# EAGLE design samd21_actuatorhub_Lite_TQFP32_1.1.2Feb_feb2023 (EAGLE 9.6.2)
MODEL: SensorHub Lite; VERSION: V1.1.2 Feb 2023

## Sheet 1 of 3
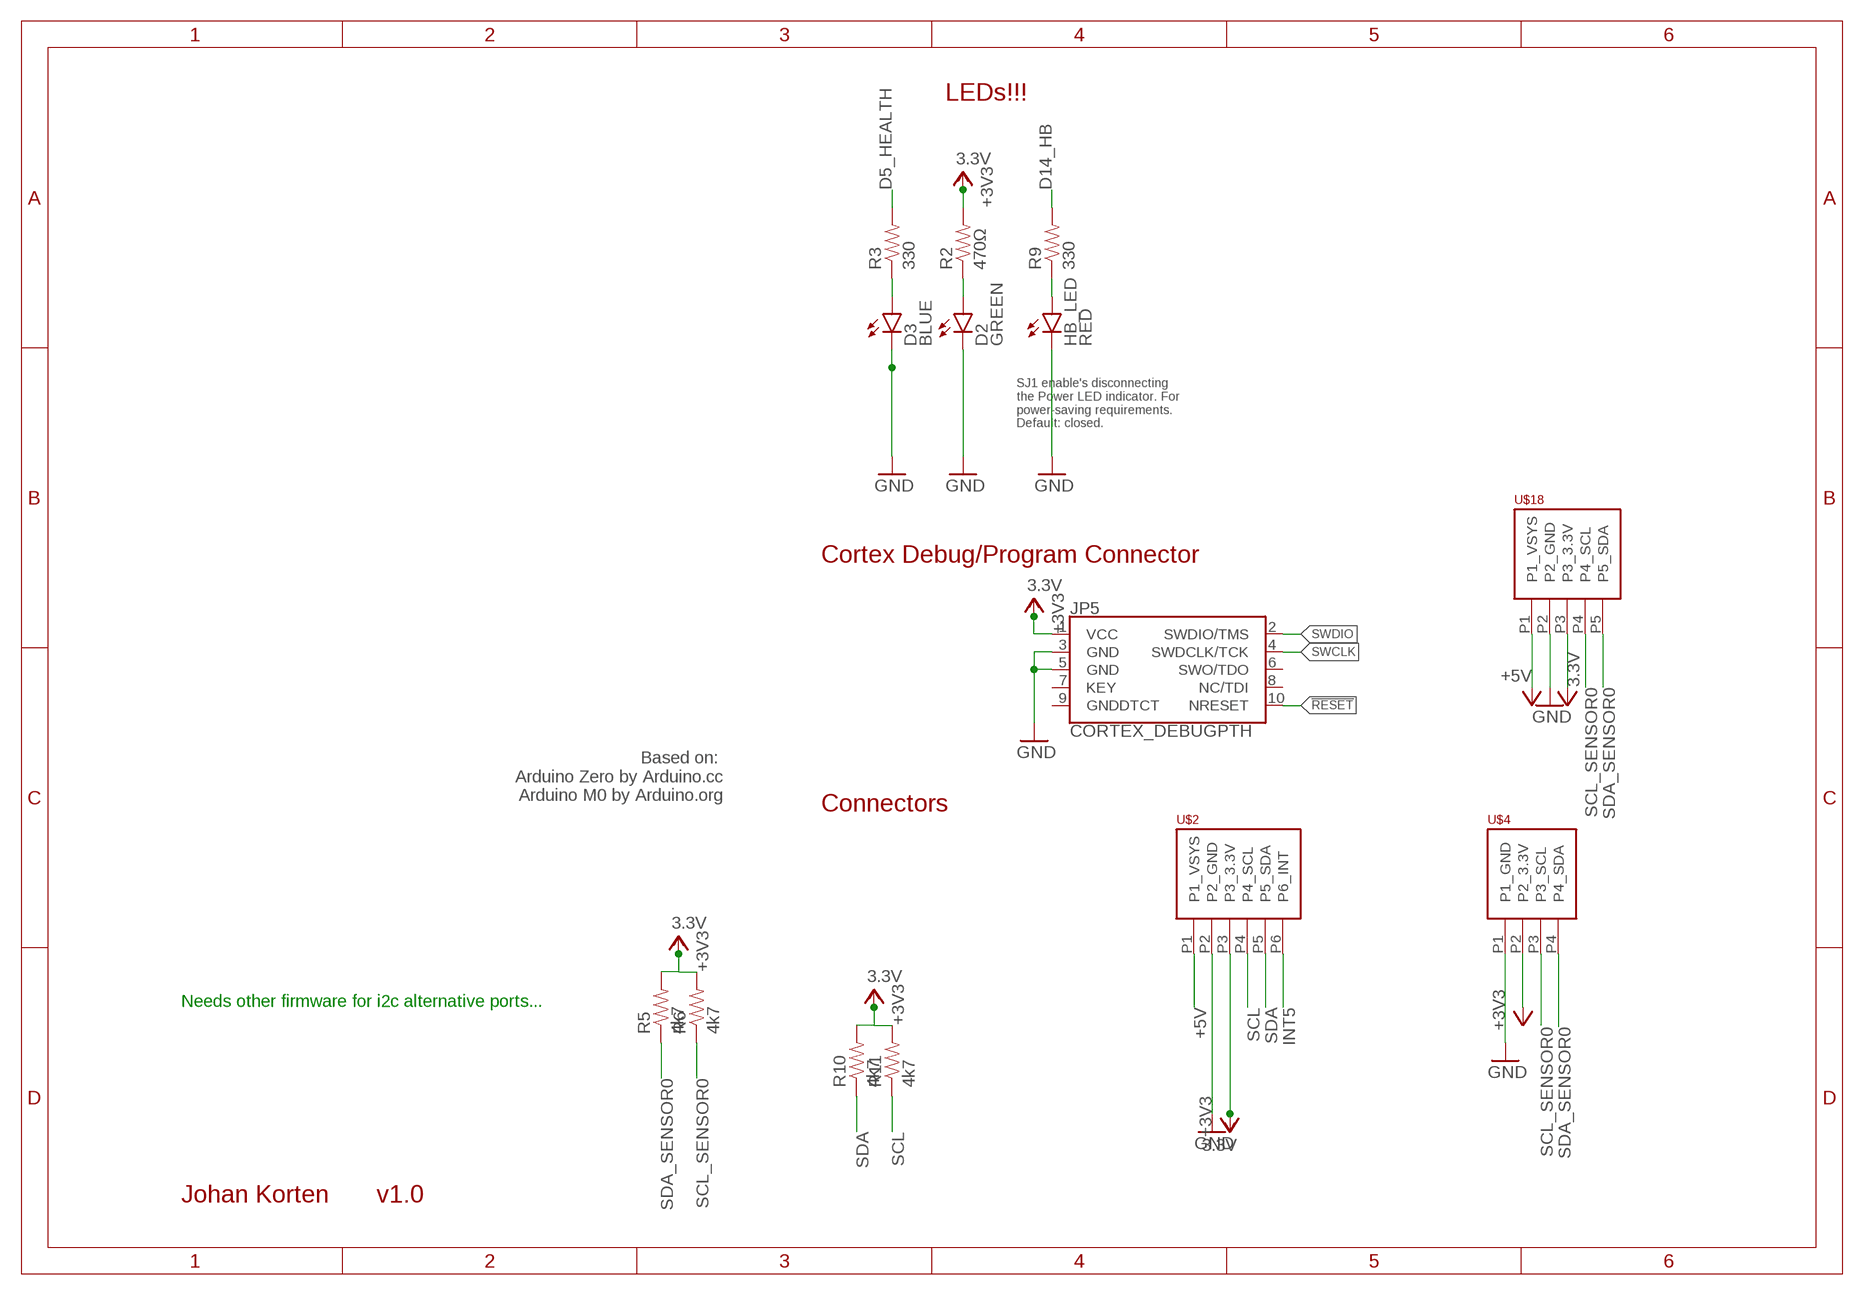
[diagram p0: schematic, sheet 1]

### Parts
D2  GREEN  LED-RED0603  [LED-0603]
D3  BLUE  LED-BLUE0603  [LED-0603]
HB_LED  RED  LED-RED0603  [LED-0603]
JP5  CORTEX_DEBUGPTH  [2X5-PTH-1.27MM]
R2  470Ω  330OHM1/10W1%(0603)  [0603-RES]
R3  330  330OHM1/10W1%(0603)  [0603-RES]
R5  4k7  330OHM1/10W1%(0603)  [0603-RES]
R6  4k7  330OHM1/10W1%(0603)  [0603-RES]
R9  330  330OHM1/10W1%(0603)  [0603-RES]
R10  4k7  330OHM1/10W1%(0603)  [0603-RES]
R11  4k7  330OHM1/10W1%(0603)  [0603-RES]
U$2  PHOENIX_PTSM_M6_TH_I2CPPANGLE  [PTSM_M6_THRHOLE]
U$4  PHOENIX_PTSM_M4_THANGLE  [PTSM_M4_TH]
U$18  PHOENIX_PTSM_M5_TH_I2C++  [PTSM_M5_THRHOLE]

### Nets
3.3V [power]: JP5.1(VCC) R2.2 R5.2 R6.2 R10.2 R11.2 U$2.P3(P3_3.3V) U$4.P2(P2_3.3V) U$18.P3(P3_3.3V) ; supply symbol labelled +3V3 ; also sheet 2
!RESET: JP5.10(NRESET) ; also sheet 2
+5V: U$2.P1(P1_VSYS) U$18.P1(P1_VSYS) ; also sheet 2,3
D5_HEALTH: R3.2 ; also sheet 2
D5_HEALTH_LED: D3.A R3.1
D14_HB: R9.2 ; also sheet 2
D14_HB_LED: HB_LED.A R9.1
GND [ground]: D2.C D3.C HB_LED.C JP5.3(GND) JP5.5(GND) U$2.P2(P2_GND) U$4.P1(P1_GND) U$18.P2(P2_GND) ; also sheet 2,3
INT5: U$2.P6(P6_INT) ; also sheet 2
N$5: D2.A R2.1
SCL: R11.1 U$2.P4(P4_SCL) ; also sheet 2
SCL_SENSOR0: R6.1 U$4.P3(P3_SCL) U$18.P4(P4_SCL) ; also sheet 2
SDA: R10.1 U$2.P5(P5_SDA) ; also sheet 2
SDA_SENSOR0: R5.1 U$4.P4(P4_SDA) U$18.P5(P5_SDA) ; also sheet 2
SWCLK: JP5.4(SWDCLK/TCK) ; also sheet 2
SWDIO: JP5.2(SWDIO/TMS) ; also sheet 2
Unconnected: JP5.6(SWO/TDO) JP5.7(KEY) JP5.8(NC/TDI) JP5.9(GNDDTCT)

### Notes on the sheet
- LEDs!!!
- SJ1 enable's disconnecting
  the Power LED indicator. For
  power-saving requirements.
  Default: closed.
- Cortex Debug/Program Connector
- Based on: 
  Arduino Zero by Arduino.cc
  Arduino M0 by Arduino.org
- Connectors
- Needs other firmware for i2c alternative ports...
- Johan Korten | v1.0

## Sheet 2 of 3: Controller SAMD21 based on Adafruit Feather M0 Express
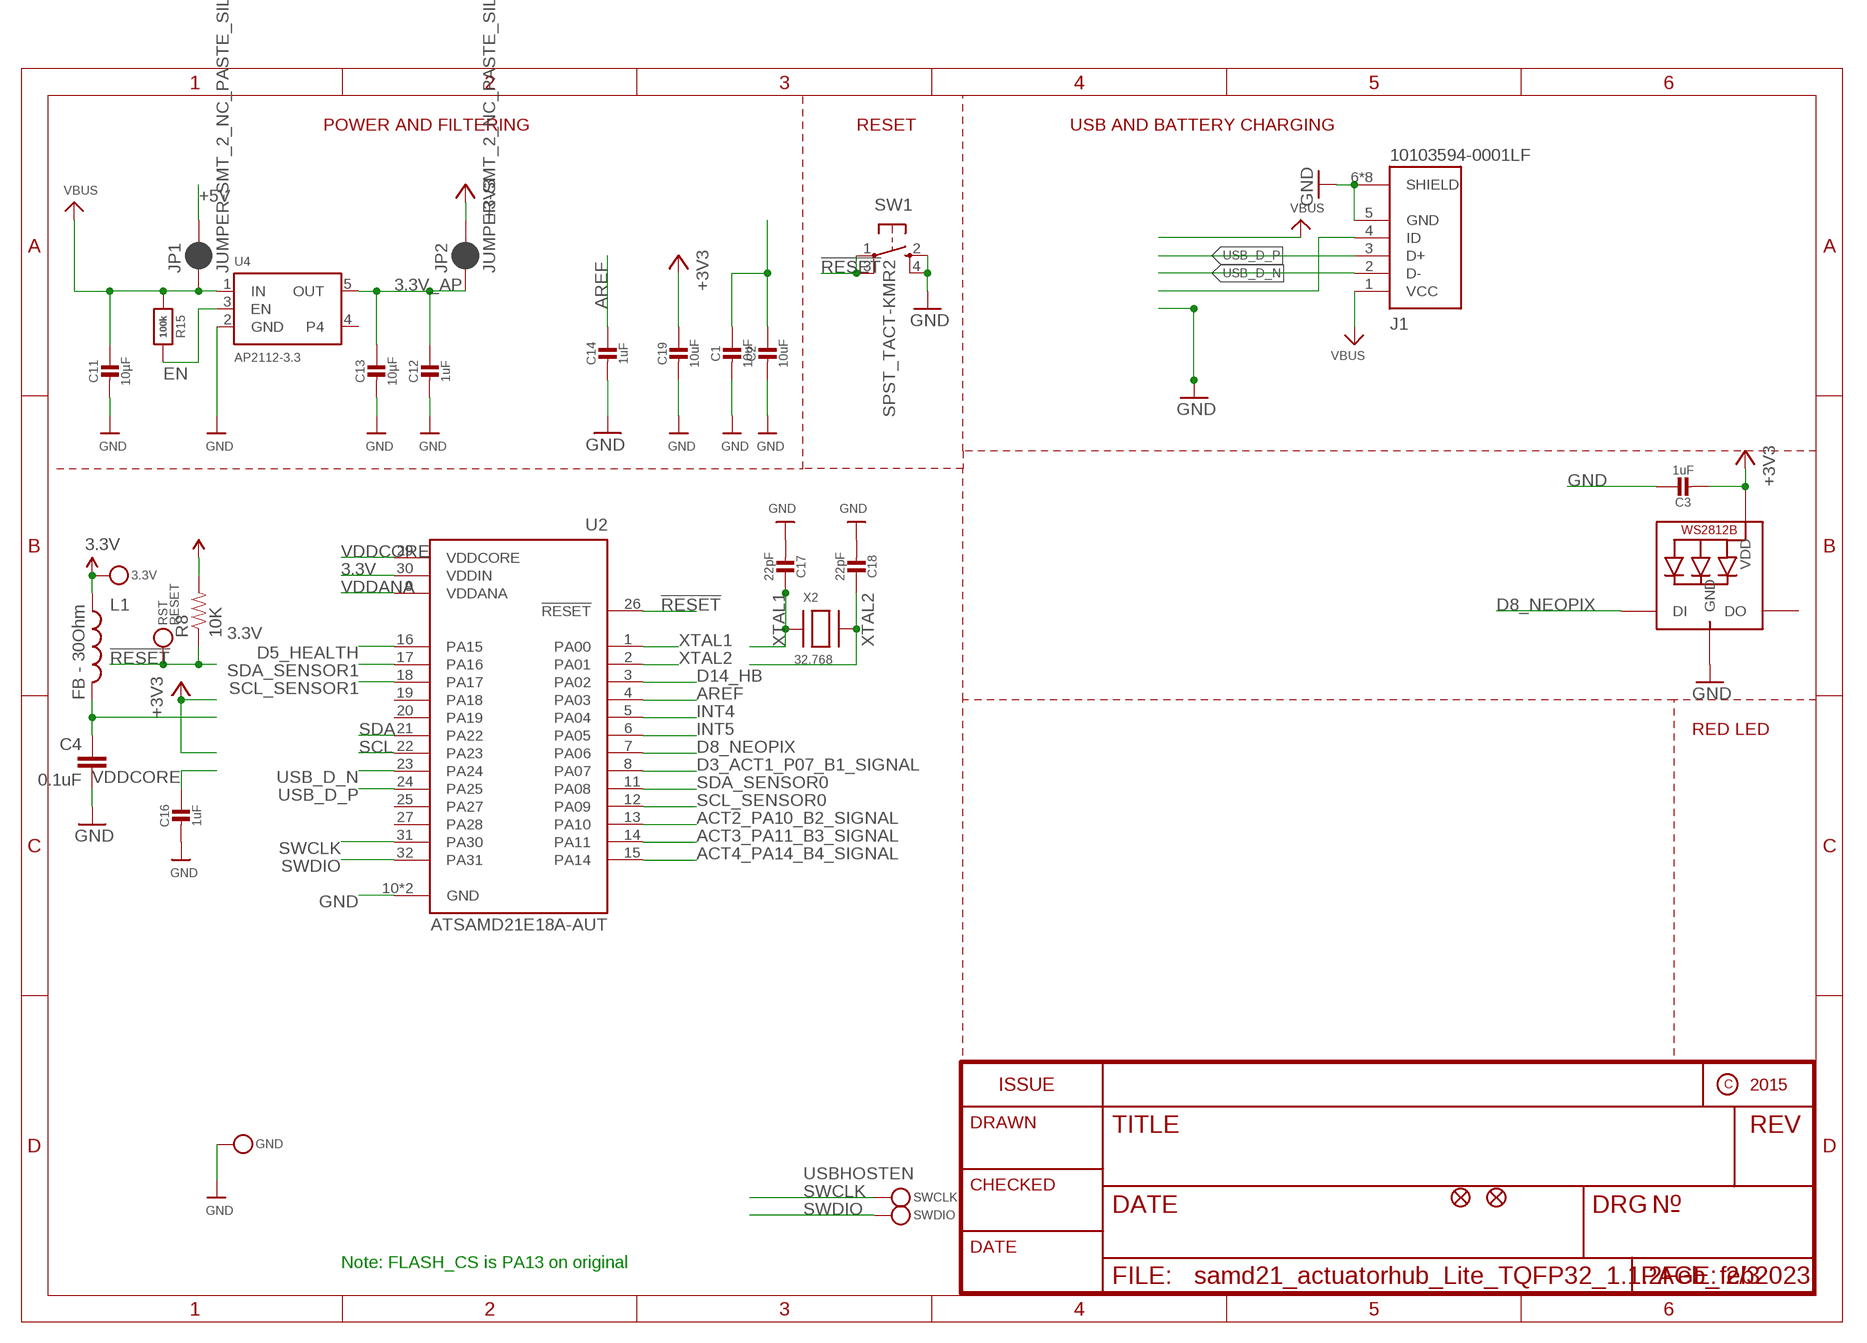
[diagram p1: schematic, sheet 2]

### Parts
3.3V  TESTPOINTROUND1.5MM  [TESTPOINT_ROUND_1.5MM]
C1  10uF  CAP_CERAMIC0805-NOOUTLINE  [0805-NO]
C2  10uF  CAP_CERAMIC0805-NOOUTLINE  [0805-NO]
C3  1uF  CAP_CERAMIC0603_NO  [0603-NO]
C4  0.1uF  0.1UF-16V(+-10%)(0402)  [0402-CAP]
C11  10µF  CAP_CERAMIC0805-NOOUTLINE  [0805-NO]
C12  1uF  CAP_CERAMIC0603_NO  [0603-NO]
C13  10µF  CAP_CERAMIC0805-NOOUTLINE  [0805-NO]
C14  1uF  CAP_CERAMIC0603_NO  [0603-NO]
C16  1uF  CAP_CERAMIC0603_NO  [0603-NO]
C17  22pF  CAP_CERAMIC0603_NO  [0603-NO]
C18  22pF  CAP_CERAMIC0603_NO  [0603-NO]
C19  10uF  CAP_CERAMIC0805-NOOUTLINE  [0805-NO]
GND  TESTPOINTROUND1.5MM  [TESTPOINT_ROUND_1.5MM]
J1  10103594-0001LF  [AMPHENOL_10103594-0001LF]
JP1  JUMPER-SMT_2_NC_PASTE_SILK  [SMT-JUMPER_2_NC_PASTE_SILK]
JP2  JUMPER-SMT_2_NC_PASTE_SILK  [SMT-JUMPER_2_NC_PASTE_SILK]
L1  FB - 30Ohm  INDUCTOR0603  [0603]
LED1  WS2812B3535  [LED3535]
R8  10K  10KOHM-1/10W-1%(0603)0603  [0603-RES]
R15  100k  RESISTOR_0603_NOOUT  [0603-NO]
RST  RESET  TESTPOINTROUND1.5MM  [TESTPOINT_ROUND_1.5MM]
SW1  SPST_TACT-KMR2  [KMR2]
SWCLK  TESTPOINTROUND1.5MM  [TESTPOINT_ROUND_1.5MM]
SWDIO  TESTPOINTROUND1.5MM  [TESTPOINT_ROUND_1.5MM]
U2  ATSAMD21E18A-AUT  [QFP80P900X900X120-32N]
U4  AP2112-3.3  VREG_SOT23-5  [SOT23-5]
U$34  FIDUCIAL""  [FIDUCIAL_1MM]
U$35  FIDUCIAL""  [FIDUCIAL_1MM]
X2  32.768  XTAL-3.2X1.5  [XTAL3215]

### Nets
3.3V [power]: 3.3V.P$1 C3.2 C19.1 JP2.2 L1.1 LED1.2(VDD) R8.2 U2.30(VDDIN) ; supply symbol labelled +3V3 ; also sheet 1
3.3V_AP [power]: C12.1 C13.1 JP2.1 U4.5(OUT)
!RESET: R8.1 RST.P$1 SW1.1(P) SW1.3(P1) U2.26(!RESET) ; also sheet 1
+5V: C1.1 C2.1 JP1.2 ; also sheet 1,3
ACT2_PA10_B2_SIGNAL: U2.13(PA10) ; also sheet 3
ACT3_PA11_B3_SIGNAL: U2.14(PA11) ; also sheet 3
ACT4_PA14_B4_SIGNAL: U2.15(PA14) ; also sheet 3
AREF [power]: C14.1 U2.4(PA03)
D3_ACT1_P07_B1_SIGNAL: U2.8(PA07) ; also sheet 3
D5_HEALTH: U2.16(PA15) ; also sheet 1
D8_NEOPIX: LED1.1(DI) U2.7(PA06)
D14_HB: U2.3(PA02) ; also sheet 1
EN: R15.2 U4.3(EN)
GND [ground]: C1.2 C2.2 C3.1 C4.2 C11.2 C12.2 C13.2 C14.2 C16.2 C17.2 C18.2 C19.2 GND.P$1 J1.5(GND) J1.6(SHIELD) J1.7(SHIELD) J1.8(SHIELD) J1.9(SHIELD) J1.10(SHIELD) J1.11(SHIELD) J1.S1(SHIELD) J1.S2(SHIELD) LED1.4(GND) SW1.2(S) SW1.4(S1) U2.10(GND) U2.28(GND) U4.2(GND) ; also sheet 1,3
INT4: U2.5(PA04)
INT5: U2.6(PA05) ; also sheet 1
N$8: J1.4(ID)
SCL: U2.22(PA23) ; also sheet 1
SCL_SENSOR0: U2.12(PA09) ; also sheet 1
SCL_SENSOR1: U2.18(PA17)
SDA: U2.21(PA22) ; also sheet 1
SDA_SENSOR0: U2.11(PA08) ; also sheet 1
SDA_SENSOR1: U2.17(PA16)
SWCLK: SWCLK.P$1 U2.31(PA30) ; also sheet 1
SWDIO: SWDIO.P$1 U2.32(PA31) ; also sheet 1
USB_D_N [usb]: J1.2(D-) U2.23(PA24)
USB_D_P [usb]: J1.3(D+) U2.24(PA25)
VBUS [power]: C11.1 J1.1(VCC) JP1.1 R15.1 U4.1(IN)
VDDANA: C4.1 L1.2 U2.9(VDDANA)
VDDCORE: C16.1 U2.29(VDDCORE)
XTAL1: C17.1 U2.1(PA00) X2.P$1
XTAL2: C18.1 U2.2(PA01) X2.P$2
Unconnected: LED1.3(DO) U2.19(PA18) U2.20(PA19) U2.25(PA27) U2.27(PA28) U4.4

### Notes on the sheet
- POWER AND FILTERING | RESET | USB AND BATTERY CHARGING
- RED LED
- USBHOSTEN
- Note: FLASH_CS is PA13 on original

## Sheet 3 of 3: Actuator Control
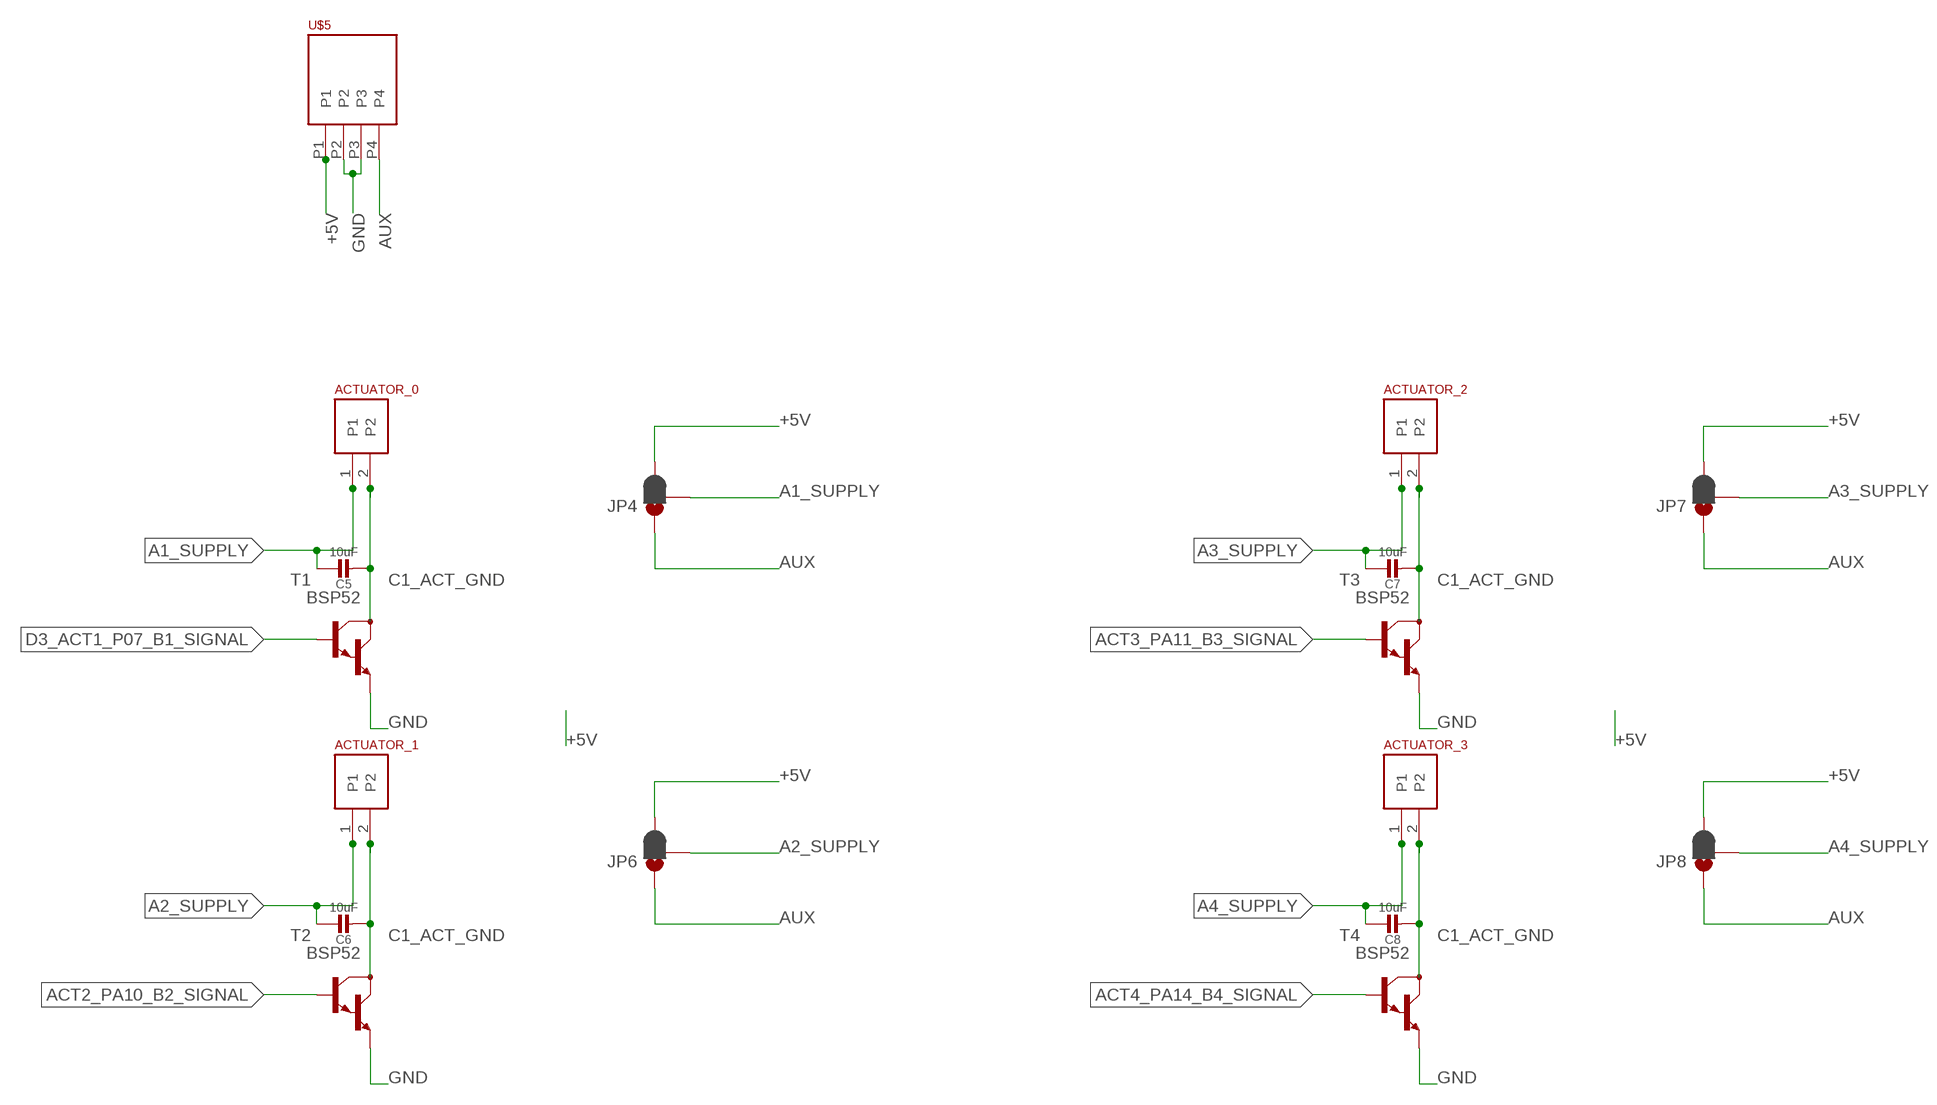
[diagram p2: schematic, sheet 3]

### Parts
ACTUATOR_0  PHOENIX_PTSM_M2TH  [PTSM_M2_THRHOLE]
ACTUATOR_1  PHOENIX_PTSM_M2TH  [PTSM_M2_THRHOLE]
ACTUATOR_2  PHOENIX_PTSM_M2TH  [PTSM_M2_THRHOLE]
ACTUATOR_3  PHOENIX_PTSM_M2TH  [PTSM_M2_THRHOLE]
C5  10uF  CAP_CERAMIC0805-NOOUTLINE  [0805-NO]
C6  10uF  CAP_CERAMIC0805-NOOUTLINE  [0805-NO]
C7  10uF  CAP_CERAMIC0805-NOOUTLINE  [0805-NO]
C8  10uF  CAP_CERAMIC0805-NOOUTLINE  [0805-NO]
JP4  JUMPER-SMT_3_1-NC_PASTE_SILK  [SMT-JUMPER_3_1-NC_PASTE_SILK]
JP6  JUMPER-SMT_3_1-NC_PASTE_SILK  [SMT-JUMPER_3_1-NC_PASTE_SILK]
JP7  JUMPER-SMT_3_1-NC_PASTE_SILK  [SMT-JUMPER_3_1-NC_PASTE_SILK]
JP8  JUMPER-SMT_3_1-NC_PASTE_SILK  [SMT-JUMPER_3_1-NC_PASTE_SILK]
T1  BSP52  [SOT-223-4]
T2  BSP52  [SOT-223-4]
T3  BSP52  [SOT-223-4]
T4  BSP52  [SOT-223-4]
U$5  PHOENIX_PTSM_M4_TH_ANGLE  [PTSM_M4_TH_ANGLE_NEUTRAL]

### Nets
+5V: JP4.3 JP6.3 JP7.3 JP8.3 U$5.P1 ; also sheet 1,2
A1_SUPPLY: ACTUATOR_0.1 C5.1 JP4.2
A2_SUPPLY: ACTUATOR_1.1 C6.1 JP6.2
A3_SUPPLY: ACTUATOR_2.1 C7.1 JP7.2
A4_SUPPLY: ACTUATOR_3.1 C8.1 JP8.2
ACT2_PA10_B2_SIGNAL: T2.1(B) ; also sheet 2
ACT3_PA11_B3_SIGNAL: T3.1(B) ; also sheet 2
ACT4_PA14_B4_SIGNAL: T4.1(B) ; also sheet 2
AUX: JP4.1 JP6.1 JP7.1 JP8.1 U$5.P4
C1_ACT_GND: ACTUATOR_0.2 ACTUATOR_1.2 ACTUATOR_2.2 ACTUATOR_3.2 C5.2 C6.2 C7.2 C8.2 T1.2(C) T1.4(C) T2.2(C) T2.4(C) T3.2(C) T3.4(C) T4.2(C) T4.4(C)
D3_ACT1_P07_B1_SIGNAL: T1.1(B) ; also sheet 2
GND [ground]: T1.3(E) T2.3(E) T3.3(E) T4.3(E) U$5.P2 U$5.P3 ; also sheet 1,2

## Library data of the parts
3.3V GND RST SWCLK SWDIO = microbuilder:TESTPOINT: Test Point Various test points for characterisation and PCB testing TESTPOINT_SMT - Compact Surface Mount Test Point [Digikey: 5016KTR-ND]
ACTUATOR_0 ACTUATOR_1-ACTUATOR_3 = jk_customs:PHOENIX_PTSM_M2
C1-C3 C5-C8 C11-C14 C16-C19 = microbuilder:CAP_CERAMIC: Ceramic Capacitors For new designs, use the packages preceded by an '_' character since they are more reliable: The following footprints should be used on most boards: _0402 - Standard footprint for regular board layouts _0603 - Standard footprint for regular board layouts _0805 - Standard footprint for regular board layouts _1206 - Standard footprint for regular board layouts For extremely tight-pitch boards where space is at a premium, the following 'micro-pitch' footprints can be used (smaller pads, no silkscreen outline, etc.): _0402MP - Micro-pitch footprint for very dense/compact boards _0603MP - Micro-pitch footprint for very dense/compact boards _0805MP - Micro-pitch footprint for very dense/compact boards _1206MP - Micro-pitch footprint for very dense/compact boards
C4 = SparkFun-Capacitors:0.1UF-16V(+-10%)(0402); PROD_ID: CAP-12416
D2 = SparkFun-LED:LED-RED: Assorted Red LEDs LilyPad 1206- DIO-09912 1206- DIO-00809 0603- DIO-00819 "SMART" means more efficient and expensive; PROD_ID: DIO-00819; VALUE: RED
D3 = SparkFun-LED:LED-BLUE: Blue LEDs for production use Various blue LEDs stocked by SparkFun production 0603 - DIO-08575 Rebel - DIO-09553 1206 - DIO-09911; PROD_ID: DIO-08575
HB_LED = SparkFun-LED:LED-RED: Assorted Red LEDs LilyPad 1206- DIO-09912 1206- DIO-00809 0603- DIO-00819 "SMART" means more efficient and expensive; PROD_ID: DIO-00819
J1 = 10103594-0001LF:10103594-0001LF: USB - micro B USB 2.0 Receptacle Connector 5 Position Surface Mount, Right Angle; Through Hole Check availability <https://pricing.snapeda.com/parts/10103594-0001LF/AMPHENOL%20ICC%20/%20FCI/view-part?ref=eda>; AVAILABILITY: In Stock; DESCRIPTION: Micro USB 2.0, Input Output Connectors, B TYPE RECEPTACLE; MF: AMPHENOL ICC / FCI; MP: 10103594-0001LF; PACKAGE: None; PRICE: None; PURCHASE-URL: https://pricing.snapeda.com/search/part/10103594-0001LF/?ref=eda
JP1 JP2 = SparkFun-Jumpers:JUMPER-SMT_2_NC_PASTE: Normally closed solder jumper This jumper has an aperture in the stencil to allow solder paste to bridge the split in the wire so it's normally closed (NC). Wick off the solder to open the connection. Reapply solder to reclose the connection.
JP4 JP6-JP8 = SparkFun-Jumpers:JUMPER-SMT_3_1-NC_PASTE: Normally closed solder jumper (1 of 2 connections) This jumper has an aperture in the stencil to allow solder paste to bridge one of the two connections. One connection is normally closed (NC), while the other is normally open (NO). Wick off the solder to open the connection. Reapply solder to reclose the connection. Apply solder to the other side instead to change the current path.
JP5 = samd21-temp:CORTEX_DEBUG: Cortex Debug Connector Datasheet <http://infocenter.arm.com/help/topic/com.arm.doc.faqs/attached/13634/cortex_debug_connectors.pdf>
L1 = SparkFun-Passives:INDUCTOR: Inductors Basic Inductor/Choke - 0603 and 1206. Footprints are not proven and vary greatly between part numbers. INDUCTOR POWER 3.3UH 4.0A SMD 0.197" L x 0.197" W x 0.177" H (5.00mm x 5.00mm x 4.50mm); PROD_ID: RES-07859
LED1 = microbuilder:WS2812B
R2 R5 R6 R10 R11 = SparkFun-Resistors:330OHM1/10W1%(0603): RES-00818; PROD_ID: RES-00818; VALUE: 330
R3 R9 = SparkFun-Resistors:330OHM1/10W1%(0603): RES-00818; PROD_ID: RES-00818
R8 = SparkFun-Resistors:10KOHM-1/10W-1%(0603): RES-00824; PROD_ID: RES-00824
R15 = microbuilder:RESISTOR: Resistors For new designs, use the packages preceded by an '_' character since they are more reliable: The following footprints should be used on most boards: _0402 - Standard footprint for regular board layouts _0603 - Standard footprint for regular board layouts _0805 - Standard footprint for regular board layouts _1206 - Standard footprint for regular board layouts For extremely tight-pitch boards where space is at a premium, the following 'micro-pitch' footprints can be used (smaller pads, no silkscreen outline, etc.): _0402MP - Micro-pitch footprint for very dense/compact boards _0603MP - Micro-pitch footprint for very dense/compact boards _0805MP - Micro-pitch footprint for very dense/compact boards _1206MP - Micro-pitch footprint for very dense/compact boards
SW1 = adafruit:SPST_TACT: SMT 6mm switch, EVQQ2 series http://www.ladyada.net/library/eagle
T1-T4 = BSP52:BSP52: BSP52: 1A, 80V, NPN Darlington Transistor 1 A Max Collector Current 80 V Max CE Voltage Datasheet <http://www.onsemi.com/pub_link/Collateral/BSP52T1-D.PDF> Check availability <https://pricing.snapeda.com/parts/BSP52/ON%20Semiconductor/view-part?ref=eda>; AVAILABILITY: In Stock; DESCRIPTION: Bipolar (BJT) Transistor NPN - Darlington 80 V 1 A - 800 mW Surface Mount SOT-223 (TO-261); MF: ON Semiconductor; MP: BSP52; PACKAGE: SOT-223-4 Fairchild Semiconductor; PRICE: None; PURCHASE-URL: https://pricing.snapeda.com/search/part/BSP52/?ref=eda
U2 = ATSAMD21E18A-AUT:ATSAMD21E18A-AUT: ARM Cortex-M0+ SAM D21E Microcontroller IC 32-Bit 48MHz 256KB (256K x 8) FLASH 32-TQFP (7x7) Check availability <https://pricing.snapeda.com/parts/ATSAMD21E18A-AU/Microchip/view-part?ref=eda>; AVAILABILITY: In Stock; DESCRIPTION: ARM® Cortex®-M0+ SAM D21E, Functional Safety (FuSa) Microcontroller IC 32-Bit Single-Core 48MHz 256KB (256K x 8) FLASH 32-TQFP (7x7); MF: Microchip; MP: ATSAMD21E18A-AU; PACKAGE: TQFP-32 Microchip; PRICE: None; PURCHASE-URL: https://pricing.snapeda.com/search/part/ATSAMD21E18A-AU/?ref=eda
U4 = microbuilder:VREG_SOT23-5: SOT23-5 Fixed Voltage Regulators Part Current Out V Out V In V Dropout θJA (°C/W) TJ (°C) Digikey Part No. ADP121 150mA 3.3V 3.4-5.5V 0.09V @ 150mA -- -- ADP121-AUJZ33R7CT-ND ADP121 150mA 3.0V 3.1-5.5V 0.09V @ 150mA -- -- ADP121-AUJZ30R7CT-ND ADP122 300mA 3.3V 3.4-5.5V 0.085V @ 300mA -- -- ADP122AUJZ-3.3-R7CT-ND ADP1712 300mA 3.3V 3.5-5.5V 0.17V @ 300mA -- -- ADP1712AUJZ-3.3-R7TR-ND AP7311 (Low Cost) 150mA 3.3V 3.5-6V 0.15V @ 150mA -- -- AP7311-33WG-7DICT-ND LD39015M18R 150mA 1.8V 1.9V-5.5V 0.08V @ 100mA -- -- 497-6977-1-ND LP2985A-33DBVR 150mA 3.3V 3.3-16V 0.28V @ 150mA 206 150 296-18479-1-ND MCP1824T-3302E/OT 300mA 3.3V 3.5V-6V 0.2V @ 300mA -- -- MCP1824T-3302E/OTCT-ND MIC5205-2.5YM5 TR 150mA 2.5V 2.7-16V 0.165V @ 150mA -- -- 576-1257-2-ND MIC5205-3.0YM5 TR 150mA 3.0V 3.2V-16V 0.165V @ 150mA -- -- 576-1258-2-ND MIC5205-3.3YM5 TR 150mA 3.3V 3.5V-16V 0.165V @ 150mA -- -- 576-1259-2-ND TPS780330220 150mA 3.3V+2.2V 3.6-5.5V 250mV Max -- -- 296-23332-1-ND TDA3663/N1,135 100mA 3.3V 3.5-45V 0.18V @ 50mA -- -- 568-5343-1-ND Max operating temp can be calculated using θJA, TJ (max junction temperature), and power in watts. Set the "Maximum Ambient Temperature" until it reaches TJ ("Max Junction Temperature"), which is the absolute limit for safe use of the regulator: Heat Sink Temperature Calculator <http://www.daycounter.com/Calculators/Heat-Sink-Temperature-Calculator.phtml> For example, With 12V source into a 3.3V LP2985 and a 30mA load, we are dissipating (12V-3.3V) * 0.03A = 0.261W. With a θJA of 206 °C/W, a TJ of 150°C, and 261mW we can safely use the chip without a heat sink up to 75°C (=147.1°C Junction Temperature).
U$2 = jk_customs:PHOENIX_PTSM_M6_TH_I2CPP
U$4 = jk_customs:PHOENIX_PTSM_M4_TH
U$5 = jk_customs:PHOENIX_PTSM_M4_TH_ANGLE
U$18 = jk_customs:PHOENIX_PTSM_M5_TH: Datasheet Phoenix PTSM 0,5/ 5-HH-2,5-THR R32 <https://www.phoenixcontact.com/online/portal/us?uri=pxc-oc-itemdetail:pid=1778654&library=usen&pdfmode=direct&pdflanguage=en>
U$34 U$35 = microbuilder:FIDUCIAL: Fiducial Alignment Points Various fiducial points for machine vision alignment.; BOM: EXCLUDE
X2 = adafruit2:XTAL: Low cost SMT crystals, no capacitors included http://www.ladyada.net/library/eagle

## Net classes
1 usb: width 0.152 mm, drill 0.254 mm, clearance 0.152 mm
2 ground: width 0.254 mm, drill 0.254 mm, clearance 0.152 mm
3 power: width 0.254 mm, drill 0.254 mm, clearance 0.152 mm

## Board
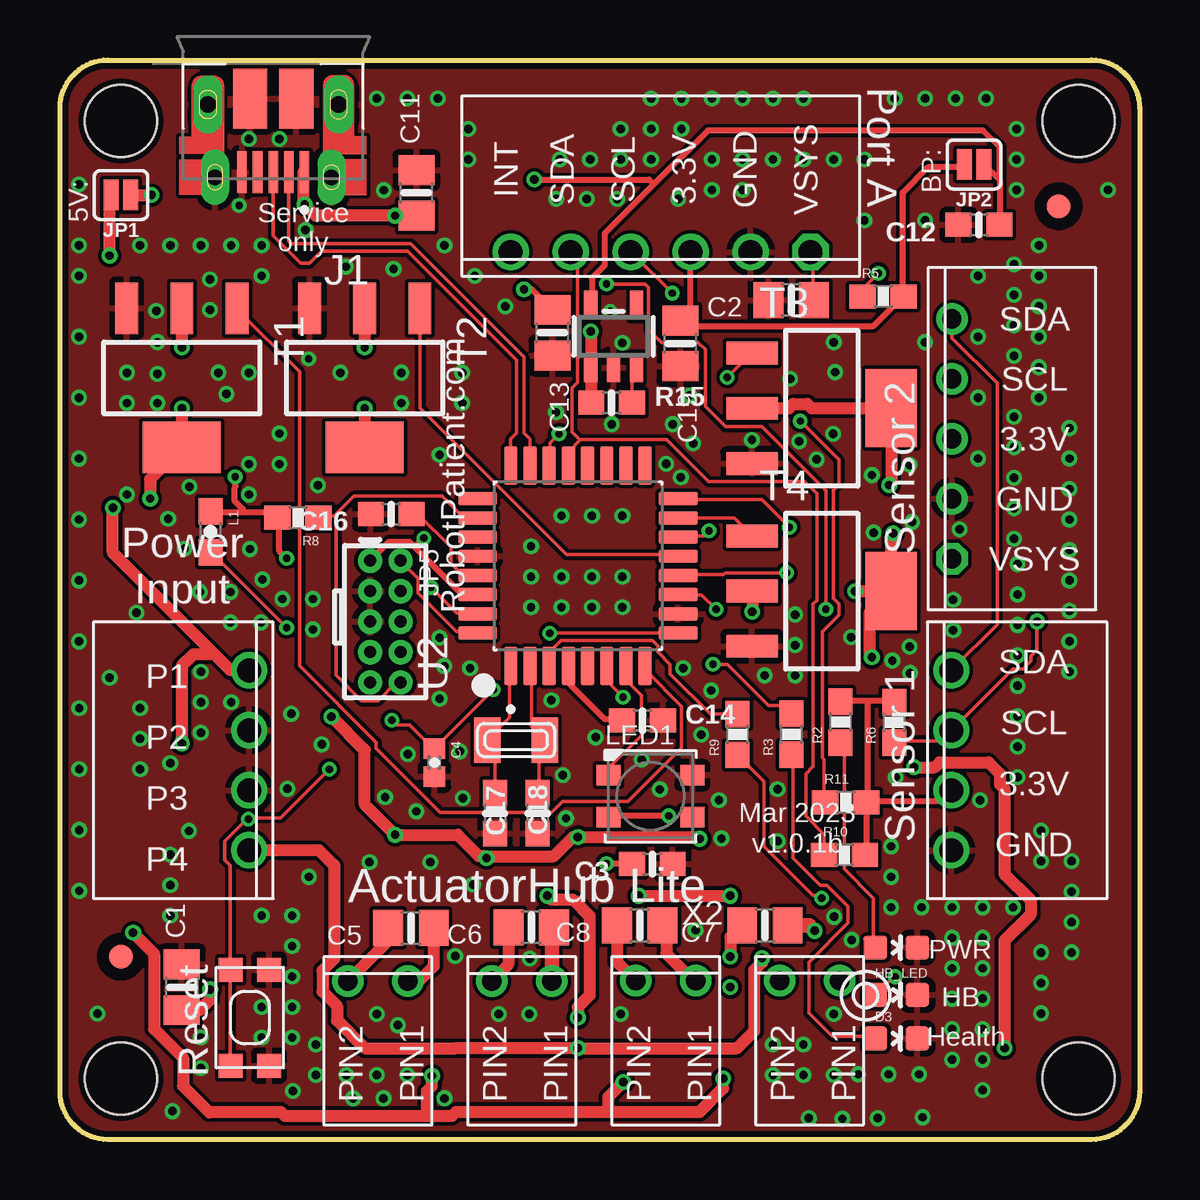
[diagram p3: board, top side]
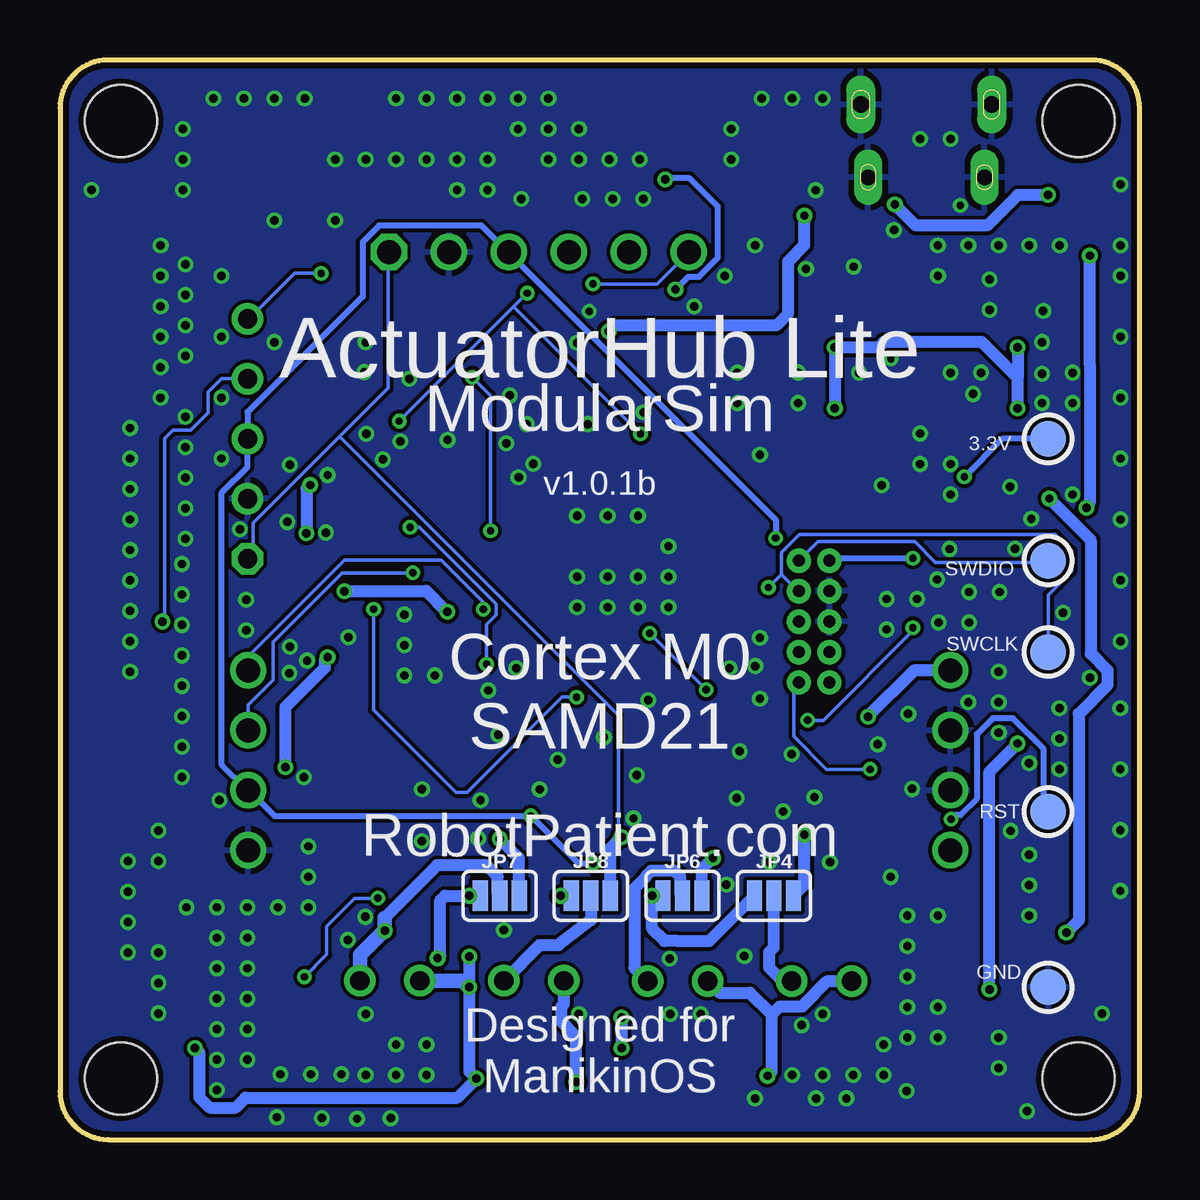
[diagram p4: board, bottom side, seen from below]

Size 45 x 45 mm. Coordinates in mm from the lower left corner, seen from the top.
Outline: 2,45 43,45 arc-90 45,43 45,2 arc-90 43,0 2,0 arc-90 0,2 0,43 arc-90 2,45
Copper layers (1*16): Top 0.035mm / dielectric 1.5mm / Bottom 0.035mm
Design rules "ITEADstudio_DRC_Recent_june2014": minimum track width 6mil, minimum drill 12mil, track to track 6mil, track to pad 6mil, pad to pad 6mil, via to via 6mil, smd to smd 0mil, copper to edge 10mil, drill to drill 10mil, minimum pad ring 10mil, minimum via ring 6mil, stop-mask expansion 2mil, vias tented up to drill 100mil, thermal gap 10mil
Holes 3 mm at 2.54,42.46 2.54,2.54 42.46,2.54 42.46,42.46

### Footprints (pad centres in the part's own frame; a part is rotated, then mirrored left to right if it is on the bottom)
TESTPOINT_ROUND_1.5MM = smd 1.5 x 1.5: P$1 0,0
PTSM_M2_THRHOLE = drill 0.8: 1 1,1; 2 3.5,1
0805-NO = smd 1.24 x 1.5: 1 -0.95,0; 2 0.95,0
0603-NO = smd 1.075 x 1: 1 -0.85,0; 2 0.85,0
0402-CAP = smd 0.85 x 0.9: 1 -0.58,0; 2 0.58,0
LED-0603 = smd 1 x 1: A 0,-0.877; C 0,0.877
AMPHENOL_10103594-0001LF = smd 0.4 x 1.75: 1 -1.3,2.825; 2 -0.65,2.825; 3 0,2.825; 4 0.65,2.825; 5 1.3,2.825 | drill 0.65 pad 0.73 long: 6 -2.425,3.03; 7 2.425,3.03 | drill 0.7 pad 1.2 long: 8 -2.725,0; 9 2.725,0 | smd 1.05 x 2.1 bottom: 10 -2.425,3.03; 11 2.425,3.03 | smd 1.425 x 2.5: S1 -0.963,-0.25; S2 0.963,-0.25
SMT-JUMPER_2_NC_PASTE_SILK = smd 0.635 x 1.27: 1 -0.406,0; 2 0.406,0
SMT-JUMPER_3_1-NC_PASTE_SILK = smd 0.635 x 1.27: 1 -0.813,0; 2 0,0; 3 0.813,0
2X5-PTH-1.27MM = drill 0.508 pad 1: 1 -2.54,-0.635; 2 -2.54,0.635; 3 -1.27,-0.635; 4 -1.27,0.635; 5 0,-0.635; 6 0,0.635; 7 1.27,-0.635; 8 1.27,0.635; 9 2.54,-0.635; 10 2.54,0.635
0603 = smd 1.1 x 1: 1 -0.85,0; 2 0.85,0
LED3535 = smd 1 x 0.85: 1 -1.75,0.875; 2 -1.75,-0.875; 3 1.75,-0.875; 4 1.75,0.875
0603-RES = smd 1.1 x 1: 1 -0.85,0; 2 0.85,0
KMR2 = smd 1 x 1: 1 2,0.8; 2 2,-0.8; 3 -2,0.8; 4 -2,-0.8
SOT-223-4 = smd 2.15 x 0.95: 1 -2.9,2.3; 2 -2.9,0; 3 -2.9,-2.3 | smd 2.15 x 3.25: 4 2.9,0
QFP80P900X900X120-32N = smd 1.6 x 0.55: 1 -4.18,2.8; 2 -4.18,2; 3 -4.18,1.2; 4 -4.18,0.4; 5 -4.18,-0.4; 6 -4.18,-1.2; 7 -4.18,-2; 8 -4.18,-2.8; 17 4.18,-2.8; 18 4.18,-2; 19 4.18,-1.2; 20 4.18,-0.4; 21 4.18,0.4; 22 4.18,1.2; 23 4.18,2; 24 4.18,2.8 | smd 0.55 x 1.6: 9 -2.8,-4.18; 10 -2,-4.18; 11 -1.2,-4.18; 12 -0.4,-4.18; 13 0.4,-4.18; 14 1.2,-4.18; 15 2,-4.18; 16 2.8,-4.18; 25 2.8,4.18; 26 2,4.18; 27 1.2,4.18; 28 0.4,4.18; 29 -0.4,4.18; 30 -1.2,4.18; 31 -2,4.18; 32 -2.8,4.18
SOT23-5 = smd 0.55 x 1.2: 1 -0.95,-1.3; 2 0,-1.3; 3 0.95,-1.3; 4 0.95,1.3; 5 -0.95,1.3
PTSM_M6_THRHOLE = drill 1 octagon: P1 6.25,1 | drill 1: P2 3.75,1; P3 1.25,1; P4 -1.25,1; P5 -3.75,1; P6 -6.25,1
PTSM_M4_TH = drill 1: P1 3.75,1; P2 1.25,1; P3 -1.25,1; P4 -3.75,1
PTSM_M4_TH_ANGLE_NEUTRAL = drill 1: P1 3.75,1; P2 1.25,1; P3 -1.25,1; P4 -3.75,1
PTSM_M5_THRHOLE = drill 0.8 octagon: P1 5,1 | drill 0.8: P2 2.5,1; P3 0,1; P4 -2.5,1; P5 -5,1
FIDUCIAL_1MM = smd 1 x 1: 1 0,0
XTAL3215 = smd 1.1 x 1.9: P$1 1.2,0; P$2 -1.2,0

### Placement (x,y rotation side)
3.3V  3.81,29.21 0 bottom
ACTUATOR_0  15.5,7.61 180 top
ACTUATOR_1  21.5,7.61 180 top
ACTUATOR_2  33.5,7.62 180 top
ACTUATOR_3  27.5,7.62 180 top
C1  5.08,6.35 90 top
C2  30.48,35 180 top
C3  24.69,11.48 180 top
C4  15.61,15.71 270 top
C5  14.63,8.81 180 top
C6  19.65,8.85 180 top
C7  29.39,8.93 180 top
C8  24.17,8.93 180 top
C11  14.86,39.46 90 top
C12  38.3,38.13 180 top
C13  20.52,33.63 270 top
C14  24.28,17.46 0 top
C16  13.8,26.07 180 top
C17  18.14,13.6 270 top
C18  19.91,13.6 270 top
C19  25.86,33.19 270 top
D2  34.86,8 270 top
D3  34.86,4.21 270 top
GND  3.81,6.35 0 bottom
HB_LED  34.86,6.03 270 top
J1  8.89,43.14 180 top
JP1  2.54,39.37 180 top
JP2  38.1,40.64 180 top
JP4  15.24,10.16 0 bottom
JP5  13.56,21.59 270 top
JP6  19.05,10.16 0 bottom
JP7  26.67,10.16 0 bottom
JP8  22.87,10.16 0 bottom
L1  6.27,25.34 270 top
LED1  24.61,14.31 0 top
R2  32.54,17.4 90 top
R3  30.49,16.89 90 top
R5  34.32,35.14 0 top
R6  34.77,17.39 90 top
R8  9.92,25.92 180 top
R9  28.24,16.88 90 top
R10  32.7,11.86 0 top
R11  32.75,14.06 0 top
R15  23,30.71 0 top
RST  3.81,13.67 0 bottom
SW1  7.91,5.08 90 top
SWCLK  3.81,20.32 0 bottom
SWDIO  3.81,24.13 0 bottom
T1  5.08,31.75 270 top
T2  12.7,31.75 270 top
T3  31.75,30.48 0 top
T4  31.75,22.86 0 top
U2  21.59,23.91 90 top
U4  23.08,33.48 0 top
U$2  25.04,36 0 top
U$4  36.15,15.81 270 top
U$5  8.89,15.81 90 top
U$18  36.18,29.21 270 top
U$34  41.63,38.9 0 top
U$35  2.54,7.62 0 top
X2  19.01,16.65 180 top

### Tracks (layer width: path | path; a pad name or v marks a point on that pad's centre or on a via)
3.3V  (via drill 0.3)
  Top 0.254: 33.68,18.29 34.75,18.29 R6.2 | 33.68,18.29 32.54,18.29 R2.2 | R10.2 33.6,11.89 33.6,14.02 R11.2 | v25.38,13.49 22.94,13.49 LED1.2 | v22.78,11.51 23.77,11.51 C3.2 | R11.2 33.68,14.1 36.65,14.1 37.11,14.55 U$4.P2 | 33.68,18.29 33.68,14.17 R11.2 | 7.62,26.14 8.91,26.14 9.07,25.98 R8.2 9.14,25.83 9.14,24.54 v9.45,24.23 | 7.62,26.14 6.33,26.14 L1.1 | 14.78,24.69 14.55,24.92 13.72,24.92 12.95,24.16 JP5.1 | 14.78,24.69 16.69,22.78 17.37,22.78 U2.30 | JP2.2 37.58,40.53 36.18,40.53 35.13,39.47 35.13,35.16 R5.2 34.86,34.83 34.82,34.82 33.91,33.91 26.06,33.91 25.91,34.06 C19.1 26.29,33.98 26.29,36.96 U$2.P3 | v15.16,25.07 14.78,24.69 | 7.62,26.14 7.62,26.28 7.27,26.64 7.27,27.14 7.3,27.17 v7.3,27.62
  Bottom 0.254: v22.78,11.51 23.39,11.51 v25.38,13.49 36.04,13.49 37.11,14.55 U$4.P2 37.26,14.63 38.25,15.62 38.25,26.98 37.19,28.04 37.19,29.18 U$18.P3 37.19,29.34 37.19,30.33 32.38,35.13 32.38,37.41 31.7,38.1 27.43,38.1 26.36,37.03 U$2.P3 26.29,36.96 15.16,25.83 v15.16,25.07 | v9.45,24.23 12.8,24.23 12.88,24.16 JP5.1 | 3.3V.P$1 5.71,29.21 v7.3,27.62
3.3V_AP  (via drill 0.35)
  Top 0.254: JP2.1 39.17,39.98 | 39.17,39.98 39.17,38.14 C12.1 | 24.76,39.82 27,42.06 38.48,42.06 39.17,41.38 39.17,39.98 | 24.76,39.82 22.71,37.77 22.71,36.44 22.17,35.9 22.17,34.9 U4.5 | C13.1 19.67,35.43 v19.34,35.43 | v19.77,40.02 24.56,40.02 24.76,39.82
  Bottom 0.254: v19.34,35.43 18.81,35.97 18.36,35.97 17.58,36.75 17.58,38.89 18.76,40.07 19.72,40.07 v19.77,40.02
!RESET  (via drill 0.3)
  Top 0.152: SW1.3 7.09,3.12 7.09,7.01 SW1.1 7.09,7.09 7.09,11.43 6.86,11.66 6.86,12.42 7.85,13.41 | 11.47,26.02 12.27,26.82 15.93,26.82 16.76,25.98 17.37,25.98 U2.26 | 11.47,26.02 11.43,25.98 10.82,25.98 R8.1 | JP5.10 14.02,19.05 13.26,18.29 12.57,18.29 11.51,19.36 11.51,25.98 11.47,26.02 | 7.85,13.41 9.21,13.41 v11.23,15.43 | v7.85,13.35 7.85,13.41
  Bottom 0.152: v11.23,15.43 13.04,15.43 14.41,16.8 14.41,19.05 JP5.10
  Bottom 0.254: v7.85,13.35 7.67,13.53 7.46,13.53 6.79,14.2 6.79,16.89 6.12,17.56 5.27,17.56 3.99,16.28 3.99,13.85 RST.P$1
+5V  (via drill 0.35)
  Top 0.152: C2.1 31.39,35.05 31.39,36.88 31.32,36.96 U$2.P1
  Top 0.508: 17.71,11.81 20.58,11.81 21.38,12.61 v21.59,12.61 26.6,12.61 v26.67,12.53 | v17.78,11.73 17.71,11.81 | 17.71,11.81 17.47,11.81 16.57,12.7 v13.97,12.7 12.7,13.97 12.7,16.24 v11.32,17.63 | U$5.P1 7.11,19.56 6.35,20.32 | v2.2,26.33 2.2,24.47 6.35,20.32 | v2.07,36.84 2.07,39.31 JP1.2 | v6.26,6.26 6.26,5.83 5.83,5.4 C1.1 | 6.35,20.32 6.26,20.23 5.56,20.23 5.08,19.75 v5.08,16.51
  Bottom 0.152: 33.34,29.3 31.32,31.32 31.32,36.96 U$2.P1 | 33.34,29.3 36.94,25.69 36.94,24.28 U$18.P1 | 33.34,29.3 21.72,17.68 21.72,12.8 v21.59,12.61
  Bottom 0.508: JP7.3 25.88,10.19 25.88,11.75 v26.67,12.53 | JP4.3 13.97,10.62 v13.97,12.7 | JP8.3 22.06,12.14 v21.59,12.61 | JP6.3 18.24,11.28 v17.78,11.73 | U$5.P1 9.38,19.56 v11.32,17.63 | v2.2,26.33 2.2,26.44 2.06,26.58 2.06,32.27 2.07,32.28 v2.07,36.84 | v6.26,6.26 6.26,15.33 v5.08,16.51
A1_SUPPLY
  Top 0.508: C5.1 15.58,7.22 14.96,6.61 ACTUATOR_0.1
  Bottom 0.508: JP4.2 15.24,8.01 15.44,7.81 15.44,7.17 14.88,6.61 ACTUATOR_0.1
A2_SUPPLY
  Top 0.61: ACTUATOR_1.1 20.5,8.76 C6.1
  Bottom 0.508: JP6.2 19.14,10.25 19.14,10.96 19.38,11.2 20.35,11.2 20.59,10.96 20.59,10.93 21.05,10.46 21.05,7.16 ACTUATOR_1.1
A3_SUPPLY  (via drill 0.35)
  Top 0.61: v31.46,8.7 31.23,8.93 C7.1
  Bottom 0.508: JP7.2 26.76,10.25 26.76,10.96 27.23,11.43 29.29,11.43 31.47,9.24
  Bottom 0.61: ACTUATOR_2.1 32.5,7.69 31.47,8.72 | 31.47,9.24 31.47,8.72 | 31.47,8.72 v31.46,8.7
A4_SUPPLY
  Top 0.508: C8.1 25.27,8.77 25.27,7.75 26.4,6.62 ACTUATOR_3.1
  Bottom 0.508: ACTUATOR_3.1 25.01,8.11 24.22,8.11 22.86,9.15 22.87,9.16 JP8.2
ACT2_PA10_B2_SIGNAL
  Top 0.152: U2.13 25.76,24.38 21.11,24.38 15.01,30.48 15.01,34.59 T2.1
ACT3_PA11_B3_SIGNAL  (via drill 0.3)
  Top 0.152: v27.05,25.38 26.82,25.15 25.83,25.15 U2.14 | v27.81,31.77 28.8,32.77 T3.1
  Bottom 0.152: v27.05,25.38 27.05,31.01 v27.81,31.77
ACT4_PA14_B4_SIGNAL
  Top 0.152: U2.15 25.83,25.91 28.12,25.91 28.8,25.22 T4.1
AREF
  Top 0.254: C14.1 23.39,17.53 22.71,17.53 21.26,18.97 21.26,19.66 U2.4
AUX  (via drill 0.35)
  Top 0.508: U$5.P4 10.8,12.06 11.43,11.43 11.43,7.54 10.94,7.05 10.94,6.17 11.54,5.56 11.54,4.97 12.7,3.81 16.51,3.81 v21.59,3.81 28.22,3.81 28.94,4.53 28.94,7.06 29.26,7.38 v29.26,7.56 | v20.32,10.16 20.47,10.01 21.39,10.01 22.08,9.31 22.08,6.02 21.59,5.52 v21.59,5.08 | v24.13,10.16 v27.94,10.16
  Bottom 0.508: JP6.1 v20.32,10.16 20.32,8.79 19.81,8.28 19.28,8.28 19.27,8.27 17.95,8.27 JP4.1 | v21.59,5.08 v21.59,3.81 | JP8.1 v24.13,10.16 | JP7.1 v27.94,10.16 28.96,10.16 29.15,9.97 29.15,7.67 v29.26,7.56
C1_ACT_GND  (via drill 0.35)
  Top 0.508: T2.2 v12.7,33.02 | v12.7,30.48 T2.4 | T1.2 v5.08,33.02 | v5.08,30.48 T1.4 3.76,27.53 v3.76,26.72 | v3.05,8.62 3.92,7.75 3.92,4.61 5.13,3.4 5.13,2.22 6.22,1.13 6.22,1.16 9.2,1.16 9.37,0.98 15.24,0.98 | 22.86,1.16 16.51,1.16 16.33,0.98 15.24,0.98 | 22.86,1.16 26.67,1.16 27.64,2.13 v27.64,2.54 | 22.86,1.16 22.86,1.78 v23.48,2.4 | v15.51,2.65 15.51,2.23 15.29,2.02 15.29,1.03 15.24,0.98 | T4.2 v28.85,22 | v33.15,22.86 T4.4 | T4.4 34.65,24.99 34.66,24.99 34.66,25.19 v34.73,25.27 | v34.57,27.28 34.65,27.36 T3.4 31.33,30.48 31.16,30.66 30.57,30.66 30.39,30.48 T3.2 | T4.4 33.74,21.95 33.74,20.21 v33.85,20.1 | v35.61,15.52 36.47,15.52 36.67,15.72 38.7,15.72 39.18,15.24 39.18,14.8 39.37,14.61 39.37,11.07 40.46,9.98 40.46,9.37 39.37,8.28 v39.37,3.81 | ACTUATOR_0.2 13.68,8.29 C5.2 | C6.2 18.7,7.3 ACTUATOR_1.2 | C8.2 23.22,7.4 ACTUATOR_3.2 | C7.2 27.94,8.43 v27.94,7.62
  Bottom 0.508: v12.7,30.48 v12.7,33.02 10.89,33.02 10.66,33.25 6.58,33.25 5.08,31.75 | v5.08,33.02 5.08,31.75 | v5.08,30.48 5.08,31.75 | v3.76,26.72 2.03,24.99 2.03,20.25 1.34,19.56 1.34,18.95 2.54,17.75 2.54,9.13 v3.05,8.62 | v23.48,2.4 23.48,4.31 24.1,4.93 24.1,5.54 24,5.64 ACTUATOR_3.2 | v15.51,2.65 15.33,2.83 15.33,5.21 | v28.85,22 29.73,22.87 33.13,22.87 v33.15,22.86 | v34.57,27.28 34.73,27.12 v34.73,25.27 | v33.85,20.1 33.96,19.99 33.96,19.66 35.61,18.01 v35.61,15.52 | v39.37,3.81 39.19,3.63 39.19,1.75 38.76,1.32 37.69,1.32 37.27,1.74 28.44,1.74 v27.64,2.54 27.94,2.84 v27.94,6.35 v27.94,7.62 | ACTUATOR_1.2 17.51,6.12 16.24,6.12 15.33,5.21 | 15.33,5.21 14.99,5.55 14.06,5.55 13,6.61 ACTUATOR_0.2
  Bottom 0.61: ACTUATOR_2.2 28.21,6.62 v27.94,6.35
D3_ACT1_P07_B1_SIGNAL
  Top 0.152: U2.8 24.46,19.66 24.46,19.51 25.91,18.06 25.91,16.32 23.69,14.1 20.95,14.1 20.5,13.64 15.85,13.64 13.18,16.31 13.18,16.56 9.98,19.76 9.98,32 7.39,34.59 T1.1
D5_HEALTH  (via drill 0.3)
  Top 0.152: v27.22,19.81 27.81,19.81 29.54,18.09 30.2,18.09 R3.2 | v30.4,25.53 29.26,26.67 25.83,26.67 U2.16
  Bottom 0.152: v27.22,19.81 27.22,21.48 26.82,21.87 26.82,22.33 30.02,25.53 v30.4,25.53
D5_HEALTH_LED
  Top 0.152: R3.1 30.56,16 30.56,11.73 31.7,10.59 31.97,10.59 32.85,9.71 32.85,9.03 31.22,7.39 31.22,5.28 32.19,4.3 33.89,4.3 D3.A
D8_NEOPIX
  Top 0.152: LED1.1 22.94,15.24 22.94,15.54 24.23,16.84 24.23,18.52 23.62,19.13 23.62,19.66 U2.7
D14_HB
  Top 0.152: U2.3 20.42,19.74 20.42,20.34 20.88,20.8 24.69,20.8 24.92,20.57 24.92,20.32 25.43,19.81 25.43,19.42 27.11,17.73 R9.2
D14_HB_LED  (via drill 0.3)
  Top 0.152: HB_LED.A 34.73,6.78 v34.81,6.78 | R9.1 29.35,14.92 29.35,12.22 31.39,10.17 31.64,10.17 v31.75,10.06
  Bottom 0.152: v34.81,6.78 33.88,7.71 33.88,8.89 32.72,10.06 v31.75,10.06
EN
  Top 0.152: R15.2 23.85,32 24,32.16 U4.3
GND  (via drill 0.3, 0.35)
  other vias: 2.79,26.89 4.51,25.87 2.79,31.97 4.06,30.7 4.06,33.24 6.6,31.97 7.87,31.97 9.14,29.43 9.14,28.16 7.87,28.16 7.87,26.89 11.68,31.97 14.22,31.97 14.22,30.7 16.76,30.7 16.76,31.97 16.03,37.27 8.41,37.27 7.14,37.27 4.6,37.27 3.33,37.27 0.79,37.27 0.79,39.81 0.79,36 0.79,33.46 0.79,30.92 0.79,28.38 0.79,25.84 0.79,23.3 0.79,20.76 5.87,19.49 7.1,22.82 9.27,22.53 10.54,22.53 10.54,21.26 8.43,23.34 8.37,21.55 9.64,17.74 10.91,16.47 9.47,14.62 13.55,14.27 15.44,11.56 12.9,11.56 4.6,15.68 4.6,11.87 5.87,4.25 5.87,2.98 8.41,5.52 8.41,4.25 9.68,5.52 8.41,9.33 10.38,10.95 10.24,37.91 11.91,36.39 13.91,36.3 20.68,30.31 23,29.82 25.54,29.82 28.84,29.16 26.25,31.01 23.44,33.21 30.81,29.11 32.23,29.41 32.26,33.24 32.31,31.99 30.44,31.71 33.85,27.7 33.92,25.3 35.52,25.74 35.42,28.13 32.98,20.94 30.65,20.61 30.65,19.34 29.38,19.34 25.98,19.65 23.44,22.19 19.63,22.19 22.17,22.19 20.9,22.19 19.63,23.46 19.63,24.73 23.44,26 22.17,26 20.9,26 23.44,23.46 22.17,23.46 20.9,23.46 15.82,28.54 10.74,27.27 17.09,19.65 15.82,18.38 15.82,20.92 22.33,16.76 20.95,15.19 20.49,18.31 25.01,14.59 24.24,15.84 26.73,16.88 27.14,18.72 27.47,14.15 27.57,12.55 29.92,12.43 29.91,14.61 32.27,9.28 32.26,5.23 32.26,2.69 29.72,3.96 30.99,2.69 29.72,2.69 31.22,0.89 34.09,0.89 32.61,0.86 30.99,3.96 23.37,5.23 18.29,5.23 19.56,5.23 13.21,5.23 14.08,4.76 14.48,2.69 13.21,2.69 10.67,2.69 17.22,10.63 19.58,7.54 26.49,8.72 34.65,10.95 34.65,9.68 34.65,12.22 35.92,9.68 37.19,9.68 37.19,8.41 37.19,7.14 37.19,5.87 37.19,4.6 37.19,3.33 35.95,0.93 38.46,2.06 38.46,3.33 38.46,4.6 38.46,5.87 38.46,7.14 38.46,8.41 38.46,9.68 39.73,9.68 34.84,15.1 39.92,15.1 39.92,18.91 39.92,22.72 37.24,22.5 37.24,21.23 34.7,19.96 39.78,27.58 39.78,25.04 37.5,25.44 38.27,28.38 38.27,30.92 39.78,30.12 39.78,32.66 38.27,33.46 38.27,36 39.78,33.93 39.78,35.2 36.07,33.24 33.53,38.32 33.53,40.86 32.26,40.86 36.07,43.4 38.61,43.4 37.34,43.4 34.8,43.4 39.88,40.86 39.88,42.13 30.99,40.86 29.72,40.86 30.99,43.4 27.18,43.4 25.91,43.4 24.64,43.4 25.91,42.13 24.64,42.13 23.37,42.13 22.1,40.86 23.37,40.86 24.64,40.86 17.02,40.86 14.48,43.4 15.75,43.4 17.02,42.13 17.3,36 8.41,36 7.87,41.71 9.14,41.71 13.21,43.4 13.5,39.57 0.8,17.98 0.8,15.44 3.34,17.98 2.07,19.25 0.8,12.9 4.6,10.6 4.6,9.33 9.68,9.33 9.68,8.06 9.68,6.79 9.68,4.25 4.69,1.18 12.22,1.71 13.49,1.71 16.03,1.71 16.47,7.65 3.19,21.96 35.81,2.72 34.54,2.72 33.27,2.72 40.89,5.26 40.89,6.53 40.89,11.61 42.16,10.34 42.16,9.07 40.89,7.8 42.16,7.8 42.16,11.61 40.89,12.88 38.35,14.15 39.92,16.37 39.92,17.64 39.92,20.18 39.92,21.45 26.39,29.02 25.27,28.17 25.88,27.61 31.55,28.35 14.86,13.68 16.79,14.22 16.66,16.18 14.5,16.07 21.09,13.39 16.01,19.74 6.93,31.08 4.06,31.92 4.01,34.54 10.36,32.54 7.47,38.94 22.94,34.52 6.25,34.58 6.25,35.85 30.65,21.88 18.57,34.73 23.23,39.2 21.96,39.2 20.69,39.2 20.83,40.86 25.77,39.2 27.18,40.86 28.45,40.86 27.18,39.59 28.45,39.59 28.45,43.4 29.72,43.4 36.07,38.32 40.81,36 40.81,34.73 40.81,33.46 40.81,32.19 40.81,30.92 39.78,36.47 40.81,37.27 39.88,39.59 43.69,39.59 7.1,21.55 5.83,22.82 5.87,18.22 5.87,16.95 7.14,18.22 3.34,15.44 3.34,16.71 5.37,12.87 0.8,10.36 11.94,2.69 10.67,3.96 9.7,2.02 5.87,37.27 39.78,28.85 39.78,26.31 42.08,29.65 42.08,28.38 42.08,27.11 39.92,23.99 42.08,25.84 42.08,24.57 42.08,23.3 42.08,22.03 42.08,20.76 42.08,19.49 35.42,20.54 35.43,19.44 7.91,24.61 5.18,24.63 5.4,27.2 2.79,30.7 32.99,8.32 1.56,5.25
  pour Top: 54.61,49.53 54.61,-3.81 -5.08,-3.81 -5.08,49.53
  pour Bottom: 55.88,49.53 55.88,-2.54 -6.35,-2.54 -6.35,49.53
INT5  (via drill 0.3)
  Top 0.152: v23.47,18.44 22.86,19.05 22.86,19.66 U2.6 | v31.93,22.1 31.93,27.05 29.26,29.72 27.74,29.72 26.9,30.56 26.9,32.92 26.59,33.22 25.07,33.22 24.54,33.76 24.54,35.51 24.38,35.66 v22.78,35.66
  Bottom 0.152: v23.47,18.44 24.08,18.44 28.04,14.48 28.5,14.48 31.93,17.91 v31.93,22.1 | v22.78,35.66 20.12,35.66 18.82,36.96 U$2.P6
N$5
  Top 0.152: D2.A 33.91,8 33.91,10.06 32.69,11.28 32.69,16.38 32.54,16.54 R2.1
SCL  (via drill 0.3)
  Top 0.152: v30.86,29.95 32.46,28.35 32.46,27.29 32.23,27.06 32.23,22.55 32.46,22.32 32.46,21.87 31.77,21.18 31.77,15.93 31.85,15.85 31.85,14.1 R11.1 | v25.53,35.28 23.85,36.96 U$2.P4 | v20.8,29.41 20.42,29.03 20.42,28.12 U2.22
  Bottom 0.152: v25.53,35.28 26.1,34.71 | 26.1,34.71 v30.86,29.95 | 26.1,34.71 v20.8,29.41
SCL_SENSOR0  (via drill 0.3, 0.35)
  Top 0.152: R6.1 34.82,16.61 36.73,16.61 37.11,16.99 U$4.P3 39.72,19.62 40.15,19.62 40.47,19.95 40.47,20.15 40.72,20.4 v40.72,21.59 | v30.29,23.62 27.74,23.62 27.66,23.55 25.83,23.55 U2.12
  Bottom 0.152: v30.29,23.62 33.24,23.62 36.12,20.74 36.12,19.15 37.15,18.12 U$4.P3 | v40.72,21.59 40.64,21.67 40.64,29.21 40.28,29.57 39.55,29.57 38.82,30.29 38.82,31.16 38.27,31.71 U$18.P4
SDA
  Top 0.152: 21.68,29.15 21.26,28.73 21.26,28.12 U2.21 | 21.68,29.15 21.72,29.18 25.27,29.18 27.03,27.43 31.04,27.43 31.55,26.92 31.55,22.48 31.39,22.33 31.39,15.54 31.09,15.24 31.09,13.49 31.85,12.72 31.85,11.89 R10.1 | U$2.P5 21.57,36.73 21.57,31.55 21.34,31.32 21.34,29.49 21.68,29.15
SDA_SENSOR0  (via drill 0.3)
  Top 0.152: v34.11,36.11 33.47,35.46 R5.1 | v27.36,22.1 26.75,22.71 25.83,22.71 U2.11 | U$18.P5 37.19,34.14 37.19,33.41 39.06,31.53 39.06,21.46 37.19,19.58 U$4.P4
  Bottom 0.152: v34.11,36.11 35.22,36.11 37.11,34.21 U$18.P5 | v27.36,22.1 27.36,22.4 29.11,24.16 33.13,24.16 37.11,20.18 37.11,19.58 U$4.P4
SWCLK  (via drill 0.3)
  Top 0.152: v15.47,23.01 16.54,21.95 17.37,21.95 U2.31
  Bottom 0.152: SWCLK.P$1 3.81,22.71 2.82,23.7 2.82,24.54 3.5,25.22 14.17,25.22 14.94,24.46 14.94,23.55 | 14.94,23.55 14.25,22.86 JP5.4 | 14.94,23.55 v15.47,23.01
SWDIO
  Top 0.152: U2.32 17.37,21.18 16.54,21.18 14.94,22.78 14.94,23.39 14.25,24.08 JP5.2
  Bottom 0.152: SWDIO.P$1 3.89,24.05 8.51,24.05 9.37,24.92 13.41,24.92 14.17,24.16 JP5.2
USB_D_N
  Top 0.152: U2.23 19.59,29.2 19.34,29.45 19.34,32.61 14.62,37.33 9.66,37.33 9.54,37.45 J1.2
USB_D_P
  Top 0.152: U2.24 18.79,29.2 19.04,29.45 19.04,32.49 14.49,37.03 10.9,37.03 10.4,36.52 10.03,36.52 8.89,37.67 J1.3
VBUS  (via drill 0.35)
  Top 0.254: R15.1 22.17,30.71 22.17,31.75 22.17,32.16 U4.1 | J1.1 10.25,40.38 10.15,40.31
  Top 0.508: JP1.1 v3.81,39.37 | 10.15,40.31 10.15,39.03 v10.2,38.98 10.66,38.51 v13.97,38.51 C11.1 | v22.13,33.69 22.13,31.8 22.17,31.75 | U4.1 22.13,30.76 22.17,30.71
  Bottom 0.508: v3.81,39.37 5.08,39.37 6.35,38.1 9.32,38.1 v10.2,38.98 | v13.97,38.51 13.97,37.27 14.64,36.6 14.64,34.43 15.14,33.93 21.88,33.93 v22.13,33.69
VDDANA  (via drill 0.3)
  Top 0.152: v18.06,18.75 15.62,16.31 C4.1 15.54,16.31 14.57,17.29 14.02,17.29 v13.83,17.48 | v20.42,21.11 25.76,21.11 U2.9 | v9.45,21.34 6.33,24.46 L1.2
  Bottom 0.152: v20.42,21.11 v18.06,18.75 | v9.45,21.34 9.45,21.21 13.18,17.48 v13.83,17.48
VDDCORE
  Top 0.152: C16.1 14.71,26.06 14.94,26.06 16.31,24.69 16.31,24 16.76,23.55 17.37,23.55 U2.29
XTAL1
  Top 0.152: C17.1 18.14,16.31 17.83,16.61 X2.P$1 17.83,16.69 18.75,17.6 18.75,19.66 U2.1
XTAL2
  Top 0.152: C18.1 19.96,14.48 19.96,16.38 20.19,16.61 X2.P$2 20.19,16.69 19.66,17.22 19.66,19.66 U2.2

### Text on the board
_tsilk: Port A | BP: | 5V: | Service / only | RobotPatient.com | Sensor 2 | Power / Input | Sensor 1 | PWR | HB | Health | Reset
_bsilk: Cortex M0 / SAMD21 | RobotPatient.com | Designed for / ManikinOS